# EAGLE schematic SAMD21_GW_M0-MINI-1591_V03 (EAGLE 8.5.1)
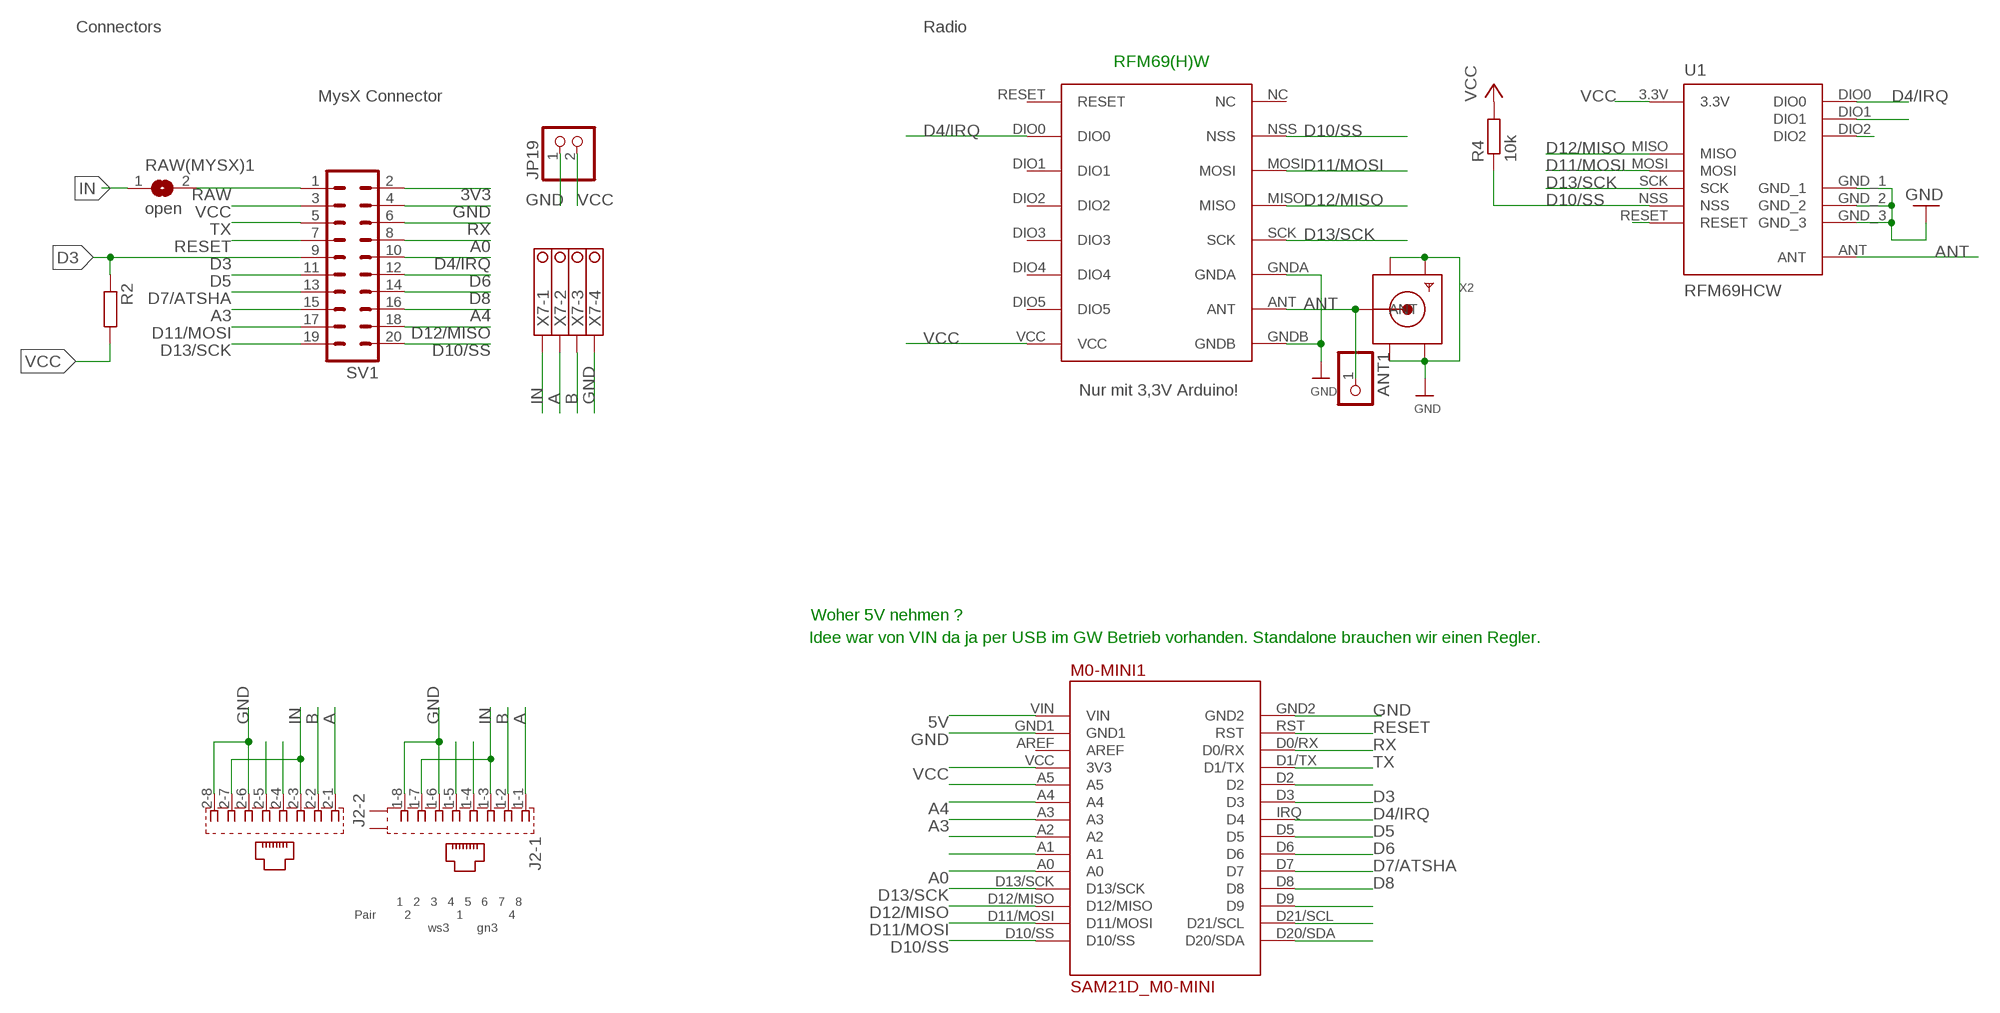
[diagram p0: schematic, sheet 1, part 1 of 2]
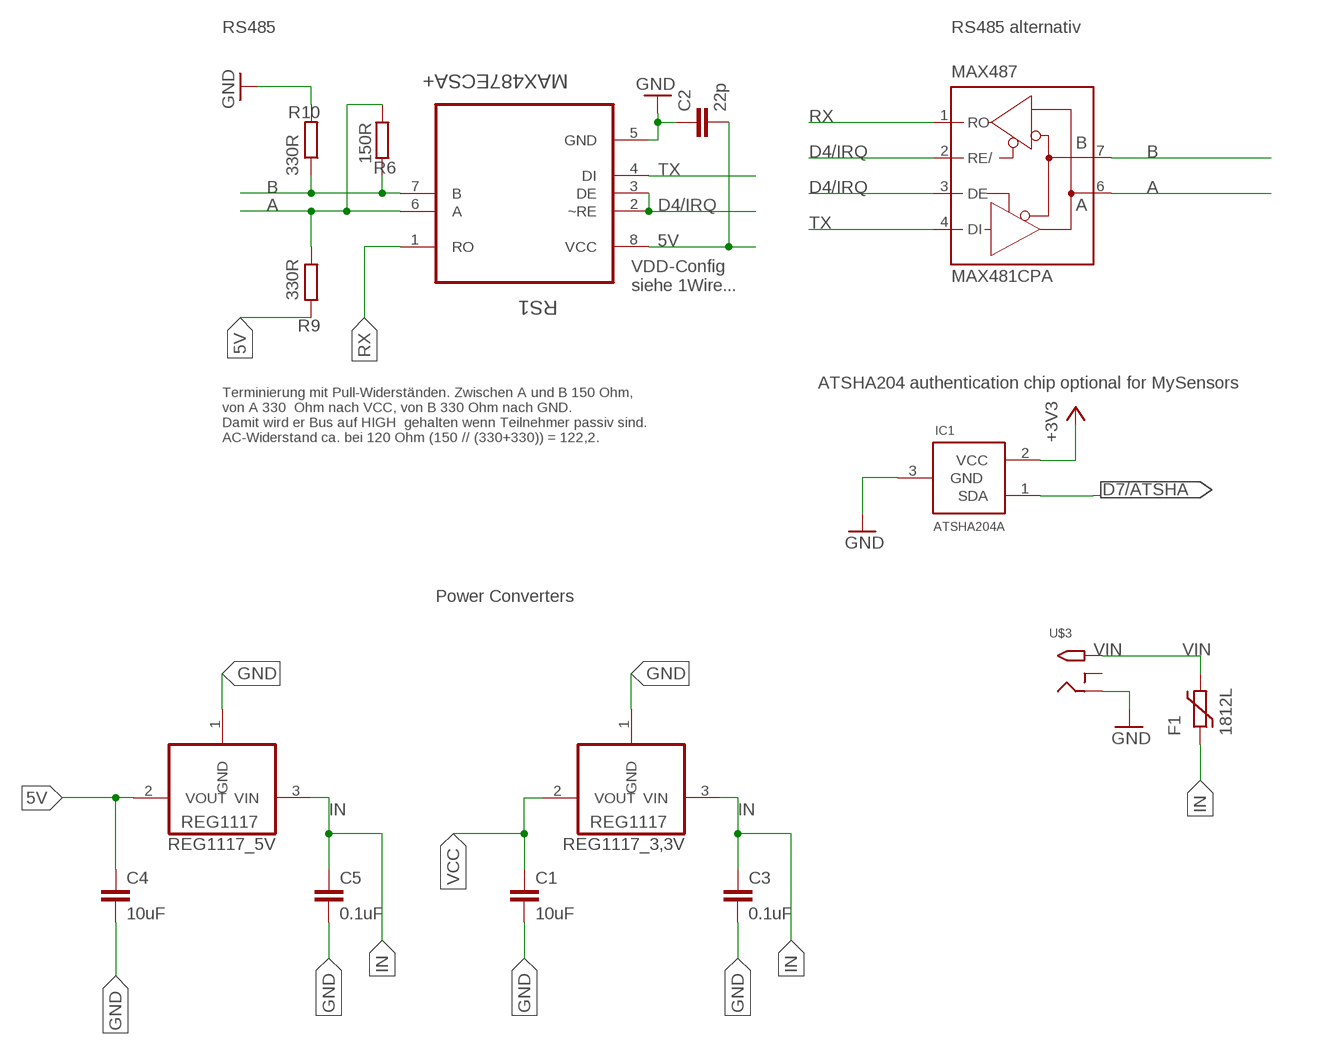
[diagram p1: schematic, sheet 1, part 2 of 2]

## Parts
ANT1  PINHD-1X1  [1X01]
C1  10uF  C-EUC1210  [C1210]
C2  22p  C-EUC0805  [C0805]
C3  0.1uF  C-EUC1206  [C1206]
C4  10uF  C-EUC1210  [C1210]
C5  0.1uF  C-EUC1206  [C1206]
F1  1812L  [1812L]
IC1  ATSHA204A  [SOT23]
J2  557570-1  [557570-1]
JP19  PINHD-1X2  [1X02]
M0-MINI1  SAM21D_M0-MINI  [SAMD21_M0-MINI]
MAX487  MAX481CPA  [DIL08]
R2  R-EU_R0805  [R0805]
R4  10k  R-EU_M0805  [M0805]
R6  150R  R-EU_R0805  [R0805]
R9  330R  R-EU_R0805  [R0805]
R10  330R  R-EU_R0805  [R0805]
RAW(MYSX)1  open  SJ  [SJ]
REG1117_3,3V  REG1117  [SOT223]
REG1117_5V  REG1117  [SOT223]
RFM69W  RFM69HW  [RFM]
RS1  MAX487ECSA+  [SOIC127P600X175-8N]
SV1  MA10-2  [MA10-2]
U1  RFM69HCW  [RFM69HCW-XXXS2]
U$3  2.1MMJACKTHM  [PJ-102A]
X2  SMACONNECTOR_EDGE  [SMA_EDGELAUNCH]
X7  1751264  [1751264]

## Nets
3V3: SV1.2
5V: C2.2 C4.1 M0-MINI1.VIN R9.1 REG1117_5V.2(VOUT) RS1.8(VCC)
A: J2.1-1 J2.2-1 MAX487.6(A) R6.1 R9.2 RS1.6(A) X7.2
A0: M0-MINI1.A0 SV1.8
A3: M0-MINI1.A3 SV1.15
A4: M0-MINI1.A4 SV1.16
ANT: ANT1.1 RFM69W.ANT U1.ANT X2.P(ANT)
B: J2.1-2 J2.2-2 MAX487.7(B) R6.2 R10.1 RS1.7(B) X7.3
D3: M0-MINI1.D3 R2.1 SV1.9
D4/IRQ: M0-MINI1.IRQ(D4) RFM69W.DIO0 RS1.2(~RE) RS1.3(DE) SV1.10 U1.DIO0
D5: M0-MINI1.D5 SV1.11
D6: M0-MINI1.D6 SV1.12
D7/ATSHA: IC1.1(SDA) M0-MINI1.D7 SV1.13
D8: M0-MINI1.D8 SV1.14
D10/SS: M0-MINI1.D10/SS R4.1 RFM69W.NSS SV1.20 U1.NSS
D11/MOSI: M0-MINI1.D11/MOSI RFM69W.MOSI SV1.17 U1.MOSI
D12/MISO: M0-MINI1.D12/MISO RFM69W.MISO SV1.18 U1.MISO
D13/SCK: M0-MINI1.D13/SCK RFM69W.SCK SV1.19 U1.SCK
GND [PWR]: C1.2 C2.1 C3.2 C4.2 C5.2 IC1.3(GND) J2.1-6 J2.1-8 J2.2-6 J2.2-8 JP19.1 M0-MINI1.GND1 M0-MINI1.GND2 R10.2 REG1117_3,3V.1(GND) REG1117_5V.1(GND) RFM69W.GNDA RFM69W.GNDB RS1.5(GND) SV1.4 U1.GND_1 U1.GND_2 U1.GND_3 U$3.RING X2.GND@1(GND4) X2.GND@2(GND3) X2.GND@3(GND2) X2.GND@4(GND1) X7.4
IN [PWR]: C3.1 C5.1 F1.P$1 J2.1-3 J2.1-7 J2.2-3 J2.2-7 RAW(MYSX)1.1 REG1117_3,3V.3(VIN) REG1117_5V.3(VIN) X7.1
N$1: MAX487.2(RE/)
N$2: J2.1-4
N$3: J2.1-5
N$4: MAX487.3(DE)
N$5: M0-MINI1.D9
N$6: J2.2-4
N$7: J2.2-5
N$10: MAX487.1(RO)
N$11: MAX487.4(DI)
N$12: U1.DIO2
N$13: U1.RESET
N$14: M0-MINI1.D2
N$15: U1.DIO1
N$25: M0-MINI1.A1
N$26: M0-MINI1.A2
N$29: M0-MINI1.A5
RAW: RAW(MYSX)1.2 SV1.1
RESET: M0-MINI1.RST SV1.7
RX: M0-MINI1.D0/RX RS1.1(RO) SV1.6
TX: M0-MINI1.D1/TX RS1.4(DI) SV1.5
VCC [PWR]: C1.1 IC1.2(VCC) JP19.2 M0-MINI1.VCC(3V3) R2.2 R4.2 REG1117_3,3V.2(VOUT) RFM69W.VCC SV1.3 U1.3.3V ; supply symbol labelled +3V3
VIN [PWR]: F1.P$2 U$3.TIP
Unconnected: J2.G1(-1:S2) J2.G3(-1:S1) M0-MINI1.AREF M0-MINI1.D20/SDA M0-MINI1.D21/SCL RFM69W.DIO1 RFM69W.DIO2 RFM69W.DIO3 RFM69W.DIO4 RFM69W.DIO5 RFM69W.NC RFM69W.RESET U$3.RING_SW

## Notes on the sheet
- Connectors | Radio | RS485 | RS485 alternativ
- RFM69(H)W
- MysX Connector
- VDD-Config
  siehe 1Wire...
- ATSHA204 authentication chip optional for MySensors
- Nur mit 3,3V Arduino!
- Terminierung mit Pull-Widerständen. Zwischen A und B 150 Ohm,
  von A 330  Ohm nach VCC, von B 330 Ohm nach GND. 
  Damit wird er Bus auf HIGH  gehalten wenn Teilnehmer passiv sind.
  AC-Widerstand ca. bei 120 Ohm (150 // (330+330)) = 122,2.
- Power Converters
- Woher 5V nehmen ?
- Idee war von VIN da ja per USB im GW Betrieb vorhanden. Standalone brauchen wir einen Regler.
- 1   2   3   4   5   6   7   8
  Pair        2             1             4
                       ws3        gn3

## Power pins joined to a net without a drawn wire
GND: MAX487.5(GND)
VCC: MAX487.8(VCC)

## Library data of the parts
ANT1 = pinhead:PINHD-1X1: PIN HEADER
C1-C5 = rcl:C-EU: CAPACITOR, European symbol; SPICEPREFIX: C
F1 = ptc-littlefuse:1812L
IC1 = Sensor:ATSHA204A
J2 = con-amp:557570-1: AMP connector
JP19 = pinhead:PINHD-1X2: PIN HEADER
M0-MINI1 = SAM21D_M0-MINI_Footprint:SAM21D_M0-MINI: Footprint SAMD21 M0-MINI
MAX487 = maxim-4:MAX481CPA: RS485 TRANSEIVER
R2 R4 R6 R9 R10 = rcl:R-EU_: RESISTOR, European symbol
RAW(MYSX)1 = jumper:SJ: SMD solder JUMPER
REG1117_3,3V REG1117_5V = burr-brown:REG1117: 800mA and 1A Low Dropout (LDO) Positive Regulator 1.8V, 2.5V, 2.85V, 3.3V, 5V, and Adj; MPN: REG1117; OC_FARNELL: 1097566; OC_NEWARK: 14P6981
RFM69W = hoperf:RFM69HW
RS1 = Maxim_By_element14_Batch_1:MAX487ECSA+: Low-Power, Slew-Rate-Limited RS-485/RS-422 Transceivers; MPN: MAX487ECSA+; OC_FARNELL: 9724532; OC_NEWARK: 68K4803; PACKAGE: SOIC-8; SUPPLIER: Maxim
SV1 = con-lstb:MA10-2: PIN HEADER; OC_FARNELL: unknown; OC_NEWARK: unknown
U1 = doug:RFM69H
U$3 = adafruit:2.1MMJACK: 2.1mm x 5.5mm THM DC jack with internal switch. Digikey part #PJ-102A, 4UCON part #05537 2.1mm x 5.5mm SMT DC jack with internal switch. Digikey part #PJ-002A-SMT, 4UCON part #03267 By microbuilder.eu & adafruit.com
X2 = adafruit:SMACONNECTOR: SMA Connector 90° DIP SMA Connector, 50 Ohm (4UConnector: 07259)
X7 = con-phoenix-350:1751264: MKDS 1/ 4-3,5 Printklemme Nennstrom: 10 A Bemessungsspannung: 160 V Raster: 3,5 mm Polzahl: 4 Montageart: Löten Anschlussart: Schraubanschluss Anschlussrichtung vom Leiter zur Platine: 0° Source: http://eshop.phoenixcontact.com .. 1751264.pdf; MPN: 1751264; OC_FARNELL: unknown; OC_NEWARK: 10R0934

## Net classes
0 default: width 0.254 mm
1 PWR: width 0.406 mm